# Altium schematic sheet as14120.SchDoc
size A3; PageSetup: Record=PageOptions|CenterHorizontal=True|CenterVertical=True|PrintScale=1.02|XCorrection=1.00|YCorrection=1.00|PrintKind=0|BorderSize=5000000|LeftOffset=0|BottomOffset=0|Orientation=2|PaperLength=4200|PaperWidth=2970|Scale=100|PaperSource=7|PrintQuality=-4|MediaType=1|DitherType=10|PaperKind=A3 (297 x 420 мм)|PrintScaleMode=1
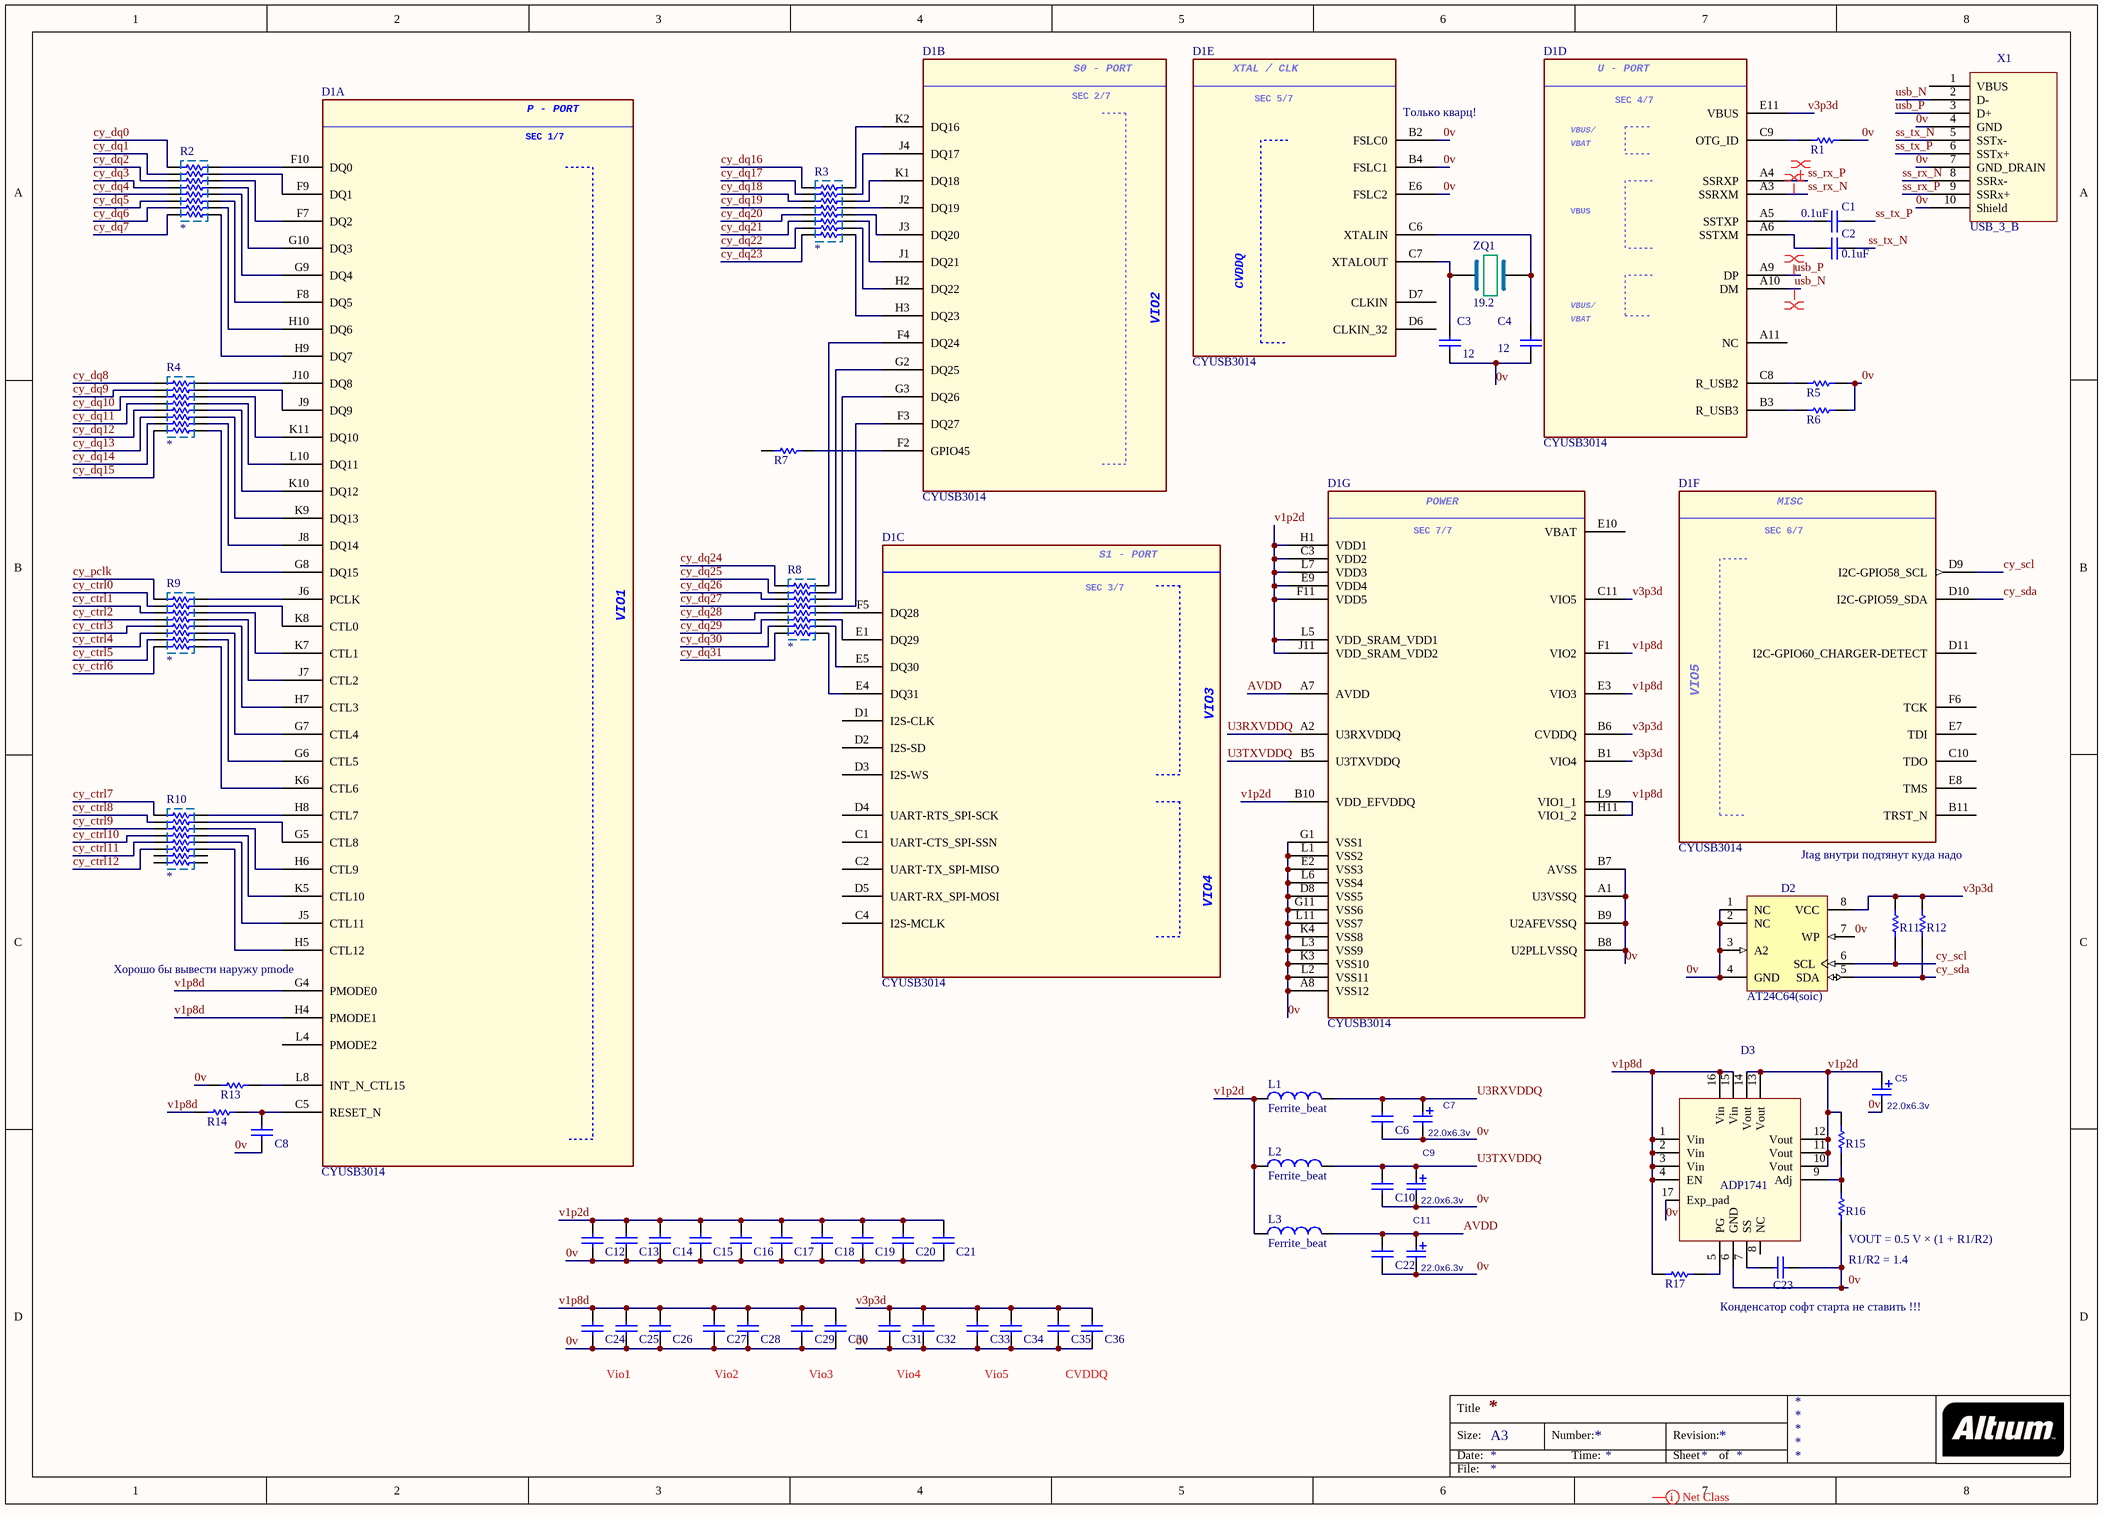
[diagram p0: as14120.SchDoc]

## Parts
C1  value 0.1uF  [CAPC0402(1005)60_M]  (hidden comment: CAP 1uF 10V 0402(1005))
C2  value 0.1uF  [CAPC0402(1005)60_M]  (hidden comment: CAP 1uF 10V 0402(1005))
C3  value 12  [CAPC0805(2012)100_N]  (hidden comment: CAP_0805)
C4  value 12  [CAPC0805(2012)100_N]  (hidden comment: CAP_0805)
C5  value 22.0x6.3v  [AVX_B]  (hidden comment: AVX_B)
C6  CAP 1uF 10V 0402(1005)  [CAPC0402(1005)60_M]  (value not drawn)
C7  value 22.0x6.3v  [AVX_B]  (hidden comment: AVX_B)
C8  CAP 1uF 10V 0402(1005)  [CAPC0402(1005)60_M]  (value not drawn)
C9  value 22.0x6.3v  [AVX_B]  (hidden comment: AVX_B)
C10  CAP 1uF 10V 0402(1005)  [CAPC0402(1005)60_M]  (value not drawn)
C11  value 22.0x6.3v  [AVX_B]  (hidden comment: AVX_B)
C12  CAP 1uF 10V 0402(1005)  [CAPC0402(1005)60_M]  (value not drawn)
C13  CAP 1uF 10V 0402(1005)  [CAPC0402(1005)60_M]  (value not drawn)
C14  CAP 1uF 10V 0402(1005)  [CAPC0402(1005)60_M]  (value not drawn)
C15  CAP 1uF 10V 0402(1005)  [CAPC0402(1005)60_M]  (value not drawn)
C16  CAP 1uF 10V 0402(1005)  [CAPC0402(1005)60_M]  (value not drawn)
C17  CAP 1uF 10V 0402(1005)  [CAPC0402(1005)60_M]  (value not drawn)
C18  CAP 1uF 10V 0402(1005)  [CAPC0402(1005)60_M]  (value not drawn)
C19  CAP 1uF 10V 0402(1005)  [CAPC0402(1005)60_M]  (value not drawn)
C20  CAP 1uF 10V 0402(1005)  [CAPC0402(1005)60_M]  (value not drawn)
C21  CAP 1uF 10V 0402(1005)  [CAPC0402(1005)60_M]  (value not drawn)
C22  CAP 1uF 10V 0402(1005)  [CAPC0402(1005)60_M]  (value not drawn)
C23  CAP 1uF 10V 0402(1005)  [CAPC0402(1005)60_M]  (value not drawn)
C24  CAP 1uF 10V 0402(1005)  [CAPC0402(1005)60_M]  (value not drawn)
C25  CAP 1uF 10V 0402(1005)  [CAPC0402(1005)60_M]  (value not drawn)
C26  CAP 1uF 10V 0402(1005)  [CAPC0402(1005)60_M]  (value not drawn)
C27  CAP 1uF 10V 0402(1005)  [CAPC0402(1005)60_M]  (value not drawn)
C28  CAP 1uF 10V 0402(1005)  [CAPC0402(1005)60_M]  (value not drawn)
C29  CAP 1uF 10V 0402(1005)  [CAPC0402(1005)60_M]  (value not drawn)
C30  CAP 1uF 10V 0402(1005)  [CAPC0402(1005)60_M]  (value not drawn)
C31  CAP 1uF 10V 0402(1005)  [CAPC0402(1005)60_M]  (value not drawn)
C32  CAP 1uF 10V 0402(1005)  [CAPC0402(1005)60_M]  (value not drawn)
C33  CAP 1uF 10V 0402(1005)  [CAPC0402(1005)60_M]  (value not drawn)
C34  CAP 1uF 10V 0402(1005)  [CAPC0402(1005)60_M]  (value not drawn)
C35  CAP 1uF 10V 0402(1005)  [CAPC0402(1005)60_M]  (value not drawn)
C36  CAP 1uF 10V 0402(1005)  [CAPC0402(1005)60_M]  (value not drawn)
D1  CYUSB3014  [BGA121C80P11X11]  (parts A,B,C,D,E,F,G of 7)
D2  AT24C64(soic)  [8S1_N]
D3  ADP1741  [CP-16-4_N]
L1  Ferrite_beat  [CAPC0805(2012)100_N]
L2  Ferrite_beat  [CAPC0805(2012)100_N]
L3  Ferrite_beat  [CAPC0805(2012)100_N]
R1  1K 5% 0603(1608)  [RESC0603(1608)_L]  (value not drawn)
R2  *  [cay16-j8]
R3  *  [cay16-j8]
R4  *  [cay16-j8]
R5  1K 1% 0805(2012)  [RESC0805(2012)_L]  (value not drawn)
R6  1K 1% 0805(2012)  [RESC0805(2012)_L]  (value not drawn)
R7  1K 5% 0603(1608)  [RESC0603(1608)_L]  (value not drawn)
R8  *  [cay16-j8]
R9  *  [cay16-j8]
R10  *  [cay16-j8]
R11  1K 5% 0603(1608)  [RESC0603(1608)_L]  (value not drawn)
R12  1K 5% 0603(1608)  [RESC0603(1608)_L]  (value not drawn)
R13  1K 5% 0603(1608)  [RESC0603(1608)_L]  (value not drawn)
R14  1K 5% 0603(1608)  [RESC0603(1608)_L]  (value not drawn)
R15  1K 1% 0805(2012)  [RESC0805(2012)_L]  (value not drawn)
R16  1K 1% 0805(2012)  [RESC0805(2012)_L]  (value not drawn)
R17  1K 5% 0603(1608)  [RESC0603(1608)_L]  (value not drawn)
X1  USB_3_B  [USB3_B]
ZQ1  value 19.2  [BCY-W2/E4.7]  (hidden comment: Resonator)

## Nets
0v: C3.1 C4.1 C5.2 C6.1 C7.2 C8.1 C9.2 C10.1 C11.2 C12.1 C13.1 C14.1 C15.1 C16.1 C17.1 C18.1 C19.1 C20.1 C21.1 C22.1 C23.1 C24.1 C25.1 C26.1 C27.1 C28.1 C29.1 C30.1 C31.1 C32.1 C33.1 C34.1 C35.1 C36.1 D1.A1(U3VSSQ) D1.A8(VSS12) D1.B2(FSLC0) D1.B4(FSLC1) D1.B7(AVSS) D1.B8(U2PLLVSSQ) D1.B9(U2AFEVSSQ) D1.D8(VSS5) D1.E2(VSS3) D1.E6(FSLC2) D1.G1(VSS1) D1.G11(VSS6) D1.K3(VSS10) D1.K4(VSS8) D1.L1(VSS2) D1.L2(VSS11) D1.L3(VSS9) D1.L6(VSS4) D1.L11(VSS7) D2.1(NC) D2.2(NC) D2.3(A2) D2.4(GND) D2.7(WP) D3.6(GND) D3.17(Exp_pad) R1.2 R5.2 R6.2 R13.2 R16.1 X1.4(GND) X1.7(GND_DRAIN) X1.10(Shield)
AVDD: C11.1 C22.2 D1.A7(AVDD) L3.2
cy_ctrl0: R9.3
cy_ctrl1: R9.5
cy_ctrl2: R9.7
cy_ctrl3: R9.9
cy_ctrl4: R9.11
cy_ctrl5: R9.13
cy_ctrl6: R9.15
cy_ctrl7: R10.1
cy_ctrl8: R10.3
cy_ctrl9: R10.5
cy_ctrl10: R10.7
cy_ctrl11: R10.9
cy_ctrl12: R10.11
cy_dq0: R2.1
cy_dq1: R2.3
cy_dq2: R2.5
cy_dq3: R2.7
cy_dq4: R2.9
cy_dq5: R2.11
cy_dq6: R2.13
cy_dq7: R2.15
cy_dq8: R4.1
cy_dq9: R4.3
cy_dq10: R4.5
cy_dq11: R4.7
cy_dq12: R4.9
cy_dq13: R4.11
cy_dq14: R4.13
cy_dq15: R4.15
cy_dq16: R3.1
cy_dq17: R3.3
cy_dq18: R3.5
cy_dq19: R3.7
cy_dq20: R3.9
cy_dq21: R3.11
cy_dq22: R3.13
cy_dq23: R3.15
cy_dq24: R8.1
cy_dq25: R8.3
cy_dq26: R8.5
cy_dq27: R8.7
cy_dq28: R8.9
cy_dq29: R8.11
cy_dq30: R8.13
cy_dq31: R8.15
cy_pclk: R9.1
cy_scl: D1.D9(I2C-GPIO58_SCL) D2.6(SCL) R11.1
cy_sda: D1.D10(I2C-GPIO59_SDA) D2.5(SDA) R12.1
ss_rx_N: D1.A3(SSRXM) X1.8(SSRx-)
ss_rx_P: D1.A4(SSRXP) X1.9(SSRx+)
ss_tx_N: C2.1 X1.5(SSTx-)
ss_tx_P: C1.1 X1.6(SSTx+)
U3RXVDDQ: C6.2 C7.1 D1.A2(U3RXVDDQ) L1.2
U3TXVDDQ: C9.1 C10.2 D1.B5(U3TXVDDQ) L2.2
usb_N: D1.A10(DM) X1.2(D-)
usb_P: D1.A9(DP) X1.3(D+)
v1p2d: C5.1 C12.2 C13.2 C14.2 C15.2 C16.2 C17.2 C18.2 C19.2 C20.2 C21.2 D1.B10(VDD_EFVDDQ) D1.C3(VDD2) D1.E9(VDD4) D1.F11(VDD5) D1.H1(VDD1) D1.J11(VDD_SRAM_VDD2) D1.L5(VDD_SRAM_VDD1) D1.L7(VDD3) D3.10(Vout) D3.11(Vout) D3.12(Vout) D3.13(Vout) D3.14(Vout) L1.1 L2.1 L3.1 R15.2
v1p8d: C24.2 C25.2 C26.2 C27.2 C28.2 C29.2 C30.2 D1.E3(VIO3) D1.F1(VIO2) D1.G4(PMODE0) D1.H4(PMODE1) D1.H11(VIO1_2) D1.L9(VIO1_1) D3.1(Vin) D3.2(Vin) D3.3(Vin) D3.4(EN) D3.15(Vin) D3.16(Vin) R14.2 R17.2
v3p3d: C31.2 C32.2 C33.2 C34.2 C35.2 C36.2 D1.B1(VIO4) D1.B6(CVDDQ) D1.C11(VIO5) D1.E11(VBUS) D2.8(VCC) R11.2 R12.2
NetC1_2: C1.2 D1.A5(SSTXP)
NetC2_2: C2.2 D1.A6(SSTXM)
NetC3_2: C3.2 D1.C7(XTALOUT) ZQ1.1
NetC4_2: C4.2 D1.C6(XTALIN) ZQ1.2
NetC8_2: C8.2 D1.C5(RESET_N) R14.1
NetC23_2: C23.2 D3.7(SS)
NetD1_B3: D1.B3(R_USB3) R6.1
NetD1_C8: D1.C8(R_USB2) R5.1
NetD1_C9: D1.C9(OTG_ID) R1.1
NetD1_E1: D1.E1(DQ29) R8.12
NetD1_E4: D1.E4(DQ31) R8.16
NetD1_E5: D1.E5(DQ30) R8.14
NetD1_F2: D1.F2(GPIO45) R7.1
NetD1_F3: D1.F3(DQ27) R8.8
NetD1_F4: D1.F4(DQ24) R8.2
NetD1_F5: D1.F5(DQ28) R8.10
NetD1_F7: D1.F7(DQ2) R2.6
NetD1_F8: D1.F8(DQ5) R2.12
NetD1_F9: D1.F9(DQ1) R2.4
NetD1_F10: D1.F10(DQ0) R2.2
NetD1_G2: D1.G2(DQ25) R8.4
NetD1_G3: D1.G3(DQ26) R8.6
NetD1_G5: D1.G5(CTL8) R10.4
NetD1_G6: D1.G6(CTL5) R9.14
NetD1_G7: D1.G7(CTL4) R9.12
NetD1_G8: D1.G8(DQ15) R4.16
NetD1_G9: D1.G9(DQ4) R2.10
NetD1_G10: D1.G10(DQ3) R2.8
NetD1_H2: D1.H2(DQ22) R3.14
NetD1_H3: D1.H3(DQ23) R3.16
NetD1_H5: D1.H5(CTL12) R10.12
NetD1_H6: D1.H6(CTL9) R10.6
NetD1_H7: D1.H7(CTL3) R9.10
NetD1_H8: D1.H8(CTL7) R10.2
NetD1_H9: D1.H9(DQ7) R2.16
NetD1_H10: D1.H10(DQ6) R2.14
NetD1_J1: D1.J1(DQ21) R3.12
NetD1_J2: D1.J2(DQ19) R3.8
NetD1_J3: D1.J3(DQ20) R3.10
NetD1_J4: D1.J4(DQ17) R3.4
NetD1_J5: D1.J5(CTL11) R10.10
NetD1_J6: D1.J6(PCLK) R9.2
NetD1_J7: D1.J7(CTL2) R9.8
NetD1_J8: D1.J8(DQ14) R4.14
NetD1_J9: D1.J9(DQ9) R4.4
NetD1_J10: D1.J10(DQ8) R4.2
NetD1_K1: D1.K1(DQ18) R3.6
NetD1_K2: D1.K2(DQ16) R3.2
NetD1_K5: D1.K5(CTL10) R10.8
NetD1_K6: D1.K6(CTL6) R9.16
NetD1_K7: D1.K7(CTL1) R9.6
NetD1_K8: D1.K8(CTL0) R9.4
NetD1_K9: D1.K9(DQ13) R4.12
NetD1_K10: D1.K10(DQ12) R4.10
NetD1_K11: D1.K11(DQ10) R4.6
NetD1_L8: D1.L8(INT_N_CTL15) R13.1
NetD1_L10: D1.L10(DQ11) R4.8
NetD3_5: D3.5(PG) R17.1
NetD3_9: D3.9(Adj) R15.1 R16.2

Not connected (* = marked no-connect by the designer): D1 A11(NC) B11(TRST_N) C1(UART-CTS_SPI-SSN) C2(UART-TX_SPI-MISO) C4(I2S-MCLK) C10(TDO) D1(I2S-CLK) D2(I2S-SD) D3(I2S-WS) D4(UART-RTS_SPI-SCK) D5(UART-RX_SPI-MOSI) D6(CLKIN_32) D7(CLKIN) D11(I2C-GPIO60_CHARGER-DETECT) E7(TDI) E8(TMS) E10(VBAT) F6(TCK) L4(PMODE2); D3 8(NC); R7 2; R10 13 14 15 16; X1 1(VBUS)

## Layout directives
net class Undefined: (no net found under the mark)
differential pair: ss_rx_N, ss_rx_P, usb_N, usb_P

## Notes on the sheet
- (near D1) Только кварц!
- Jtag внутри подтянут куда надо
- (near D1) Хорошо бы вывести наружу pmode
- (near R16) VOUT = 0.5 V × (1 + R1/R2)
- R1/R2 = 1.4
- Конденсатор софт старта не ставить !!!
- Vio1
- Vio2
- Vio3
- Vio4
- Vio5
- CVDDQ
- Title
- Size:
- Date:
- A3
- Number:
- Time:
- Revision:
- Sheet
- of
- File:
- (in symbol CYUSB3014-BZXC, part A) P - PORT; SEC 1/7; VIO1
- (in symbol CYUSB3014-BZXC, part B) S0 - PORT; SEC 2/7
- (in symbol CYUSB3014-BZXC, part C) S1 - PORT; SEC 3/7
- (in symbol CYUSB3014-BZXC, part D) U - PORT; SEC 4/7; VBUS/
- (in symbol CYUSB3014-BZXC, part E) XTAL / CLK; SEC 5/7
- (in symbol CYUSB3014-BZXC, part F) MISC; SEC 6/7
- (in symbol CYUSB3014-BZXC, part G) POWER; SEC 7/7

## Library data of the parts
C1 C2 C6 C8 C10 C12-C36 = CAP_0402: CAP 1uF 10V ±20% 0402 (1005 Metric) Thickness 0.6mm SMD; Case-Metric: 1005; Case-EIA: 0402; Tolerance: ±20%; Max Thickness: 0.6 mm; Rated Voltage: 10 V; Technology: SMT
  C6 C8 C10 C12-C36: Value: 1uF
D1 = CYUSB3014-BZXC
D2 = AT24C08BN-SP25-T: 8Kbit (1024 x 8), 2-wire Bus Automotive Serial EEPROM with Write Protect, 2.5V, 8-Pin SOIC, Tape & Reel; DatasheetVersion: 8517C,  Jan-2009; PackageVersion: revC, Mar-2005; PackageReference: 8S1; PackageDescription: 8-Lead (0.150" Wide Body), Plastic Gull Wing Small Outline (JEDEC SOIC); Code_JEDEC: MS-012-AA; Code_IPC: SOIC127P600-8; ComponentLink1Description: Manufacturer URL; ComponentLink1URL: http://www.atmel.com/; ComponentLink2Description: Datasheet; ComponentLink2URL: http://www.atmel.com/dyn/resources/prod_documents/doc8517.pdf
R1 R7 R11-R14 R17 = RES_0603: 1K 0.1W 5% 0603 (1608 Metric)  SMD; Case-EIA: 0603; Case-Metric: 1608; Value: 1000.00 Ohm; Technology: SMT; Tolerance: 5 %; Power: 0.1 W
R2-R4 R8-R10 = cay16-j8: Value: *
R5 R6 R15 R16 = RES_0805: 1K 0.125W 1% 0805 (2012 Metric)  SMD; Case-Metric: 2012; Value: 1000.00 Ohm; Case-EIA: 0805; Tolerance: 1 %; Power: 0.125 W; Technology: SMT